# EAGLE design IrrigationSystemShield (EAGLE 6.5.0)
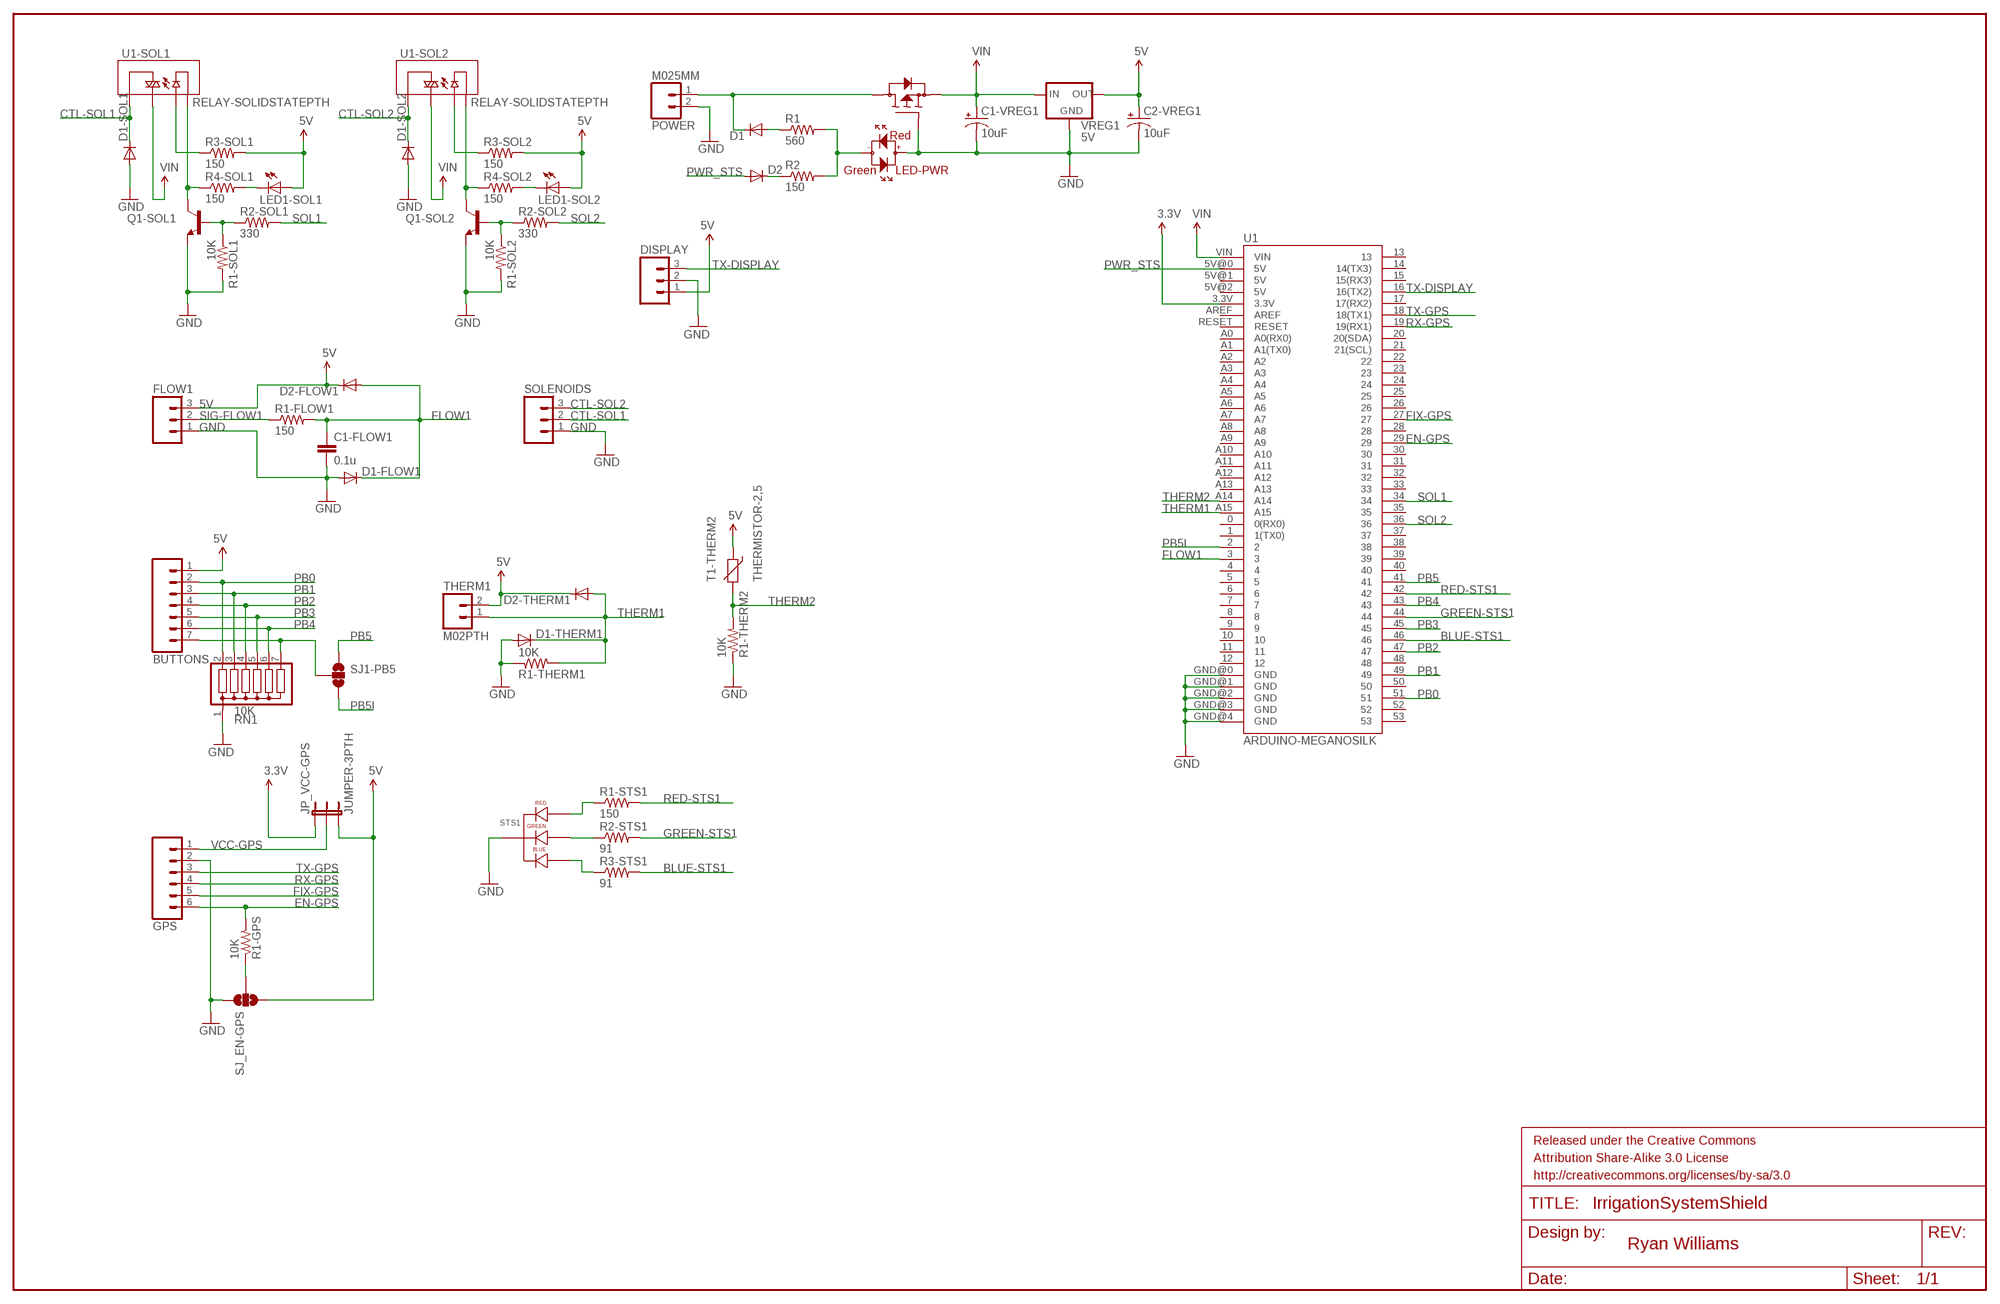
[diagram p0: schematic, sheet 1]

## Parts
BUTTONS  M07  [1X07]
C1-FLOW1  0.1u  CAPPTH1  [CAP-PTH-5MM]
C1-VREG1  10uF  10UF-25V-20%(PTH)  [CPOL-RADIAL-10UF-25V]
C2-VREG1  10uF  10UF-25V-20%(PTH)  [CPOL-RADIAL-10UF-25V]
D1  DIODEPTH  [DIODE-1N4001]
D1-FLOW1  DIODE1N4148  [DIODE-1N4148]
D1-SOL1  DIODEPTH  [DIODE-1N4001]
D1-SOL2  DIODEPTH  [DIODE-1N4001]
D1-THERM1  DIODE1N4148  [DIODE-1N4148]
D2  DIODEPTH  [DIODE-1N4001]
D2-FLOW1  DIODE1N4148  [DIODE-1N4148]
D2-THERM1  DIODE1N4148  [DIODE-1N4148]
DISPLAY  M03JST-PTH  [JST-3-PTH]
FET-1  P-FET  [FQP27P06]
FLOW1  M03-SCREW-5MM  [SCREWTERMINAL-5MM-3]
FRAME1  FRAME-LEDGER  [CREATIVE_COMMONS]
GPS  M06SIP  [1X06]
JP_VCC-GPS  JUMPER-3PTH  [1X03]
LED1-SOL1  LED5MM  [LED5MM]
LED1-SOL2  LED5MM  [LED5MM]
LED-PWR  LED-BIPOLARHGL*3362  [LED-5MM]
POWER  M025MM  [SCREWTERMINAL-5MM-2]
Q1-SOL1  TRANSISTOR_NPNTO92  [TO-92]
Q1-SOL2  TRANSISTOR_NPNTO92  [TO-92]
R1  560  RESISTORPTH-1/2W  [AXIAL-0.5]
R1-FLOW1  150  RESISTORPTH-1/4W  [AXIAL-0.4]
R1-GPS  10K  RESISTORPTH-1/4W  [AXIAL-0.4]
R1-SOL1  10K  RESISTORPTH-1/4W  [AXIAL-0.4]
R1-SOL2  10K  RESISTORPTH-1/4W  [AXIAL-0.4]
R1-STS1  150  RESISTORPTH-1/4W  [AXIAL-0.4]
R1-THERM1  10K  RESISTORPTH-1/4W  [AXIAL-0.4]
R1-THERM2  10K  RESISTORPTH-1/4W  [AXIAL-0.4]
R2  150  RESISTORPTH-1/4W  [AXIAL-0.4]
R2-SOL1  330  RESISTORPTH-1/4W  [AXIAL-0.4]
R2-SOL2  330  RESISTORPTH-1/4W  [AXIAL-0.4]
R2-STS1  91  RESISTORPTH-1/4W  [AXIAL-0.4]
R3-SOL1  150  RESISTORPTH-1/4W  [AXIAL-0.4]
R3-SOL2  150  RESISTORPTH-1/4W  [AXIAL-0.4]
R3-STS1  91  RESISTORPTH-1/4W  [AXIAL-0.4]
R4-SOL1  150  RESISTORPTH-1/4W  [AXIAL-0.4]
R4-SOL2  150  RESISTORPTH-1/4W  [AXIAL-0.4]
RN1  10K  G06R  [SIL7]
SJ1-PB5  SOLDERJUMPER_2WAYS  [SJ_3]
SJ_EN-GPS  SOLDERJUMPER_2WAYS  [SJ_3]
SOLENOIDS  M03-SCREW-5MM  [SCREWTERMINAL-5MM-3]
STS1  LED-RGB-CC-THRUDIFFUSE  [LED-RGB-THRU]
T1-THERM2  THERMISTOR-2,5  [RS-2,5]
THERM1  M02PTH  [1X02]
U1  ARDUINO-MEGANOSILK  [ARDUINO_MEGA_NOSILK]
U1-SOL1  RELAY-SOLIDSTATEPTH  [RELAY-S108T02]
U1-SOL2  RELAY-SOLIDSTATEPTH  [RELAY-S108T02]
VREG1  5V  V_REG_78XXSINK  [TO220-IGO]

## Nets
3.3V [Power]: JP_VCC-GPS.1 U1.3.3V
5V [Power]: BUTTONS.1 C2-VREG1.1(+) D2-FLOW1.C D2-THERM1.C DISPLAY.1 FLOW1.3 JP_VCC-GPS.3 LED1-SOL1.A LED1-SOL2.A R3-SOL1.P$2 R3-SOL2.P$2 SJ_EN-GPS.3 T1-THERM2.1 THERM1.2 VREG1.OUT
BLUE-STS1: R3-STS1.P$2 U1.46
CTL-SOL1: D1-SOL1.C SOLENOIDS.2 U1-SOL1.1(T1)
CTL-SOL2: D1-SOL2.C SOLENOIDS.3 U1-SOL2.1(T1)
EN-GPS: GPS.6 R1-GPS.P$2 U1.29
FIX-GPS: GPS.5 U1.27
FLOW1: C1-FLOW1.1 D1-FLOW1.C D2-FLOW1.A R1-FLOW1.P$2 U1.3
GND [Power]: C1-FLOW1.2 C1-VREG1.2(-) C2-VREG1.2(-) D1-FLOW1.A D1-SOL1.A D1-SOL2.A D1-THERM1.A DISPLAY.2 FET-1.GATE FLOW1.1 GPS.2 LED-PWR.ANODE POWER.2 Q1-SOL1.1(E) Q1-SOL2.1(E) R1-SOL1.P$2 R1-SOL2.P$2 R1-THERM1.P$1 R1-THERM2.P$1 RN1.1 SJ_EN-GPS.1 SOLENOIDS.1 STS1.2(CATHODE) U1.GND@0(GND) U1.GND@1(GND) U1.GND@2(GND) U1.GND@3(GND) U1.GND@4(GND) VREG1.GND
GREEN-STS1: R2-STS1.P$2 U1.44
N$1: Q1-SOL2.2(B) R1-SOL2.P$1 R2-SOL2.P$1
N$2: Q1-SOL1.2(B) R1-SOL1.P$1 R2-SOL1.P$1
N$3: LED1-SOL1.K(C) R4-SOL1.P$2
N$4: Q1-SOL1.3(C) R4-SOL1.P$1 U1-SOL1.4(-)
N$5: R3-SOL1.P$1 U1-SOL1.3(+)
N$6: LED1-SOL2.K(C) R4-SOL2.P$2
N$7: Q1-SOL2.3(C) R4-SOL2.P$1 U1-SOL2.4(-)
N$8: R3-SOL2.P$1 U1-SOL2.3(+)
N$9 [Power]: D1.C FET-1.DRAIN POWER.1
N$10: R1-STS1.P$1 STS1.1(RED_CATHODE)
N$11: R1-GPS.P$1 SJ_EN-GPS.2
N$12: R2-STS1.P$1 STS1.3(GREEN_CATHODE)
N$13: R3-STS1.P$1 STS1.4(BLUE_CATHODE)
N$14: D2.C R2.P$1
N$15: LED-PWR.CATHODE R1.P$2 R2.P$2
N$16: D1.A R1.P$1
PB0: BUTTONS.2 RN1.2 U1.51
PB1: BUTTONS.3 RN1.3 U1.49
PB2: BUTTONS.4 RN1.4 U1.47
PB3: BUTTONS.5 RN1.5 U1.45
PB4: BUTTONS.6 RN1.6 U1.43
PB5: SJ1-PB5.1 U1.41
PB5I: SJ1-PB5.3 U1.2
PB5RAW: BUTTONS.7 RN1.7 SJ1-PB5.2
PWR_STS: D2.A U1.5V@0(5V)
RED-STS1: R1-STS1.P$2 U1.42
RX-GPS: GPS.4 U1.19(19(RX1))
SIG-FLOW1: FLOW1.2 R1-FLOW1.P$1
SOL1: R2-SOL1.P$2 U1.34
SOL2: R2-SOL2.P$2 U1.36
THERM1: D1-THERM1.C D2-THERM1.A R1-THERM1.P$2 THERM1.1 U1.A15
THERM2: R1-THERM2.P$2 T1-THERM2.2 U1.A14
TX-DISPLAY: DISPLAY.3 U1.16(16(TX2))
TX-GPS: GPS.3 U1.18(18(TX1))
VCC-GPS: GPS.1 JP_VCC-GPS.2
VIN [Power]: C1-VREG1.1(+) FET-1.SOURCE U1-SOL1.2(T2) U1-SOL2.2(T2) U1.VIN VREG1.IN
Unconnected: U1.0(0(RX0)) U1.1(1(TX0)) U1.4 U1.5 U1.5V@1(5V) U1.5V@2(5V) U1.6 U1.7 U1.8 U1.9 U1.10 U1.11 U1.12 U1.13 U1.14(14(TX3)) U1.15(15(RX3)) U1.17(17(RX2)) U1.20(20(SDA)) U1.21(21(SCL)) U1.22 U1.23 U1.24 U1.25 U1.26 U1.28 U1.30 U1.31 U1.32 U1.33 U1.35 U1.37 U1.38 U1.39 U1.40 U1.48 U1.50 U1.52 U1.53 U1.A0(A0(RX0)) U1.A1(A1(TX0)) U1.A2 U1.A3 U1.A4 U1.A5 U1.A6 U1.A7 U1.A8 U1.A9 U1.A10 U1.A11 U1.A12 U1.A13 U1.AREF U1.RESET

## Library data of the parts
BUTTONS = SparkFun-Connectors:M07: Header 7 Standard 7-pin 0.1" header. Use with straight break away headers (SKU : PRT-00116), right angle break away headers (PRT-00553), swiss pins (PRT-00743), machine pins (PRT-00117), and female headers (PRT-00115). NOTES ON THE VARIANTS LOCK and LOCK_LONGPADS... This footprint was designed to help hold the alignment of a through-hole component (i.e. 7-pin header) while soldering it into place. You may notice that each hole has been shifted either up or down by 0.005 of an inch from it's more standard position (which is usually a perfectly straight line). This slight alteration caused the pins (the squares in the middle) to touch the edges of the holes. Because they are alternating, it causes a "brace" to hold the header in place. 0.005 has proven to be the perfect amount of "off-center" position when using our standard breakaway headers. Although looks a little odd when you look at the bare footprint, once you have a header in there, the alteration is very hard to notice. Also, if you push a header all the way into place, it is covered up entirely on the bottom side. This idea of altering the position of holes to aid alignment will be further integrated into the Sparkfun Library for other footprints. It can help hold any component with 3 or more connection pins.
C1-FLOW1 = SparkFun-Capacitors:CAP: Capacitor Standard 0603 ceramic capacitor, and 0.1" leaded capacitor.
C1-VREG1 C2-VREG1 = SparkFun-Capacitors:10UF-25V-20%(PTH): CAP-08440; PROD_ID: CAP-08440
D1 D1-FLOW1 D1-SOL1 D1-SOL2 D1-THERM1 D2 D2-FLOW1 D2-THERM1 = SparkFun-DiscreteSemi:DIODE: Diode These are standard reverse protection diodes and small signal diodes. SMA package can handle up to about 1A. SOD-323 can handle about 200mA. What the SOD-323 package when ordering, there are some mfgs out there that are 5-pin packages.
DISPLAY FLOW1 SOLENOIDS = SparkFun-Connectors:M03: Header 3 Standard 3-pin 0.1" header. Use with straight break away headers (SKU : PRT-00116), right angle break away headers (PRT-00553), swiss pins (PRT-00743), machine pins (PRT-00117), and female headers (PRT-00115). Molex polarized connector foot print use with SKU : PRT-08232 with associated crimp pins and housings.
FET-1 = Library:P-FET
FRAME1 = SparkFun-Aesthetics:FRAME-LEDGER: Schematic Frame Standard 11x14 US Ledger frame
GPS = SparkFun-Connectors:M06: Header 6 Standard 6-pin 0.1" header. Use with straight break away headers (SKU : PRT-00116), right angle break away headers (PRT-00553), swiss pins (PRT-00743), machine pins (PRT-00117), and female headers (PRT-00115). Molex polarized connector foot print use with SKU : PRT-08094 with associated crimp pins and housings. NOTES ON THE VARIANTS LOCK and LOCK_LONGPADS... This footprint was designed to help hold the alignment of a through-hole component (i.e. 6-pin header) while soldering it into place. You may notice that each hole has been shifted either up or down by 0.005 of an inch from it's more standard position (which is a perfectly straight line). This slight alteration caused the pins (the squares in the middle) to touch the edges of the holes. Because they are alternating, it causes a "brace" to hold the component in place. 0.005 has proven to be the perfect amount of "off-center" position when using our standard breakaway headers. Although looks a little odd when you look at the bare footprint, once you have a header in there, the alteration is very hard to notice. Also,if you push a header all the way into place, it is covered up entirely on the bottom side. This idea of altering the position of holes to aid alignment will be further integrated into the Sparkfun Library for other footprints. It can help hold any component with 3 or more connection pins.
JP_VCC-GPS = SparkFun-Passives:JUMPER-3
LED1-SOL1 LED1-SOL2 = SparkFun-LED:LED: LEDs Standard schematic elements and footprints for 5mm, 3mm, 1206, and 0603 sized LEDs. 5mm - Spark Fun Electronics SKU : COM-00529 (and others)
LED-PWR = Library:LED-BIPOLAR; COLOR_FORWARD: Red; COLOR_REVERSE: Green
POWER THERM1 = SparkFun-Connectors:M02: Standard 2-pin 0.1" header. Use with - straight break away headers ( PRT-00116) - right angle break away headers (PRT-00553) - swiss pins (PRT-00743) - machine pins (PRT-00117) - female headers (PRT-00115) Molex polarized connector foot print use with: PRT-08233 with associated crimp pins and housings. 2.54_SCREWTERM for use with PRT-10571. 3.5mm Screw Terminal footprints for PRT-08084 5mm Screw Terminal footprints for use with PRT-08433
Q1-SOL1 Q1-SOL2 = SparkFun-DiscreteSemi:TRANSISTOR_NPN: Generic NPN BJT MMBT2222A - TRANS-08049 (SOT-23, 1A 40V) MPSA42 - TRANS-09116 (SOT-23, 500mA 300V) MMBT5088LT1G - TRANS-11160 (SOT-23, 50 mA 30V)
R1 R1-FLOW1 R1-GPS R1-SOL1 R1-SOL2 R1-STS1 R1-THERM1 R1-THERM2 R2 R2-SOL1 R2-SOL2 R2-STS1 R3-SOL1 R3-SOL2 R3-STS1 R4-SOL1 R4-SOL2 = SparkFun-Resistors:RESISTOR: Resistor Basic schematic elements and footprints for 0603, 1206, and PTH resistors.
RN1 = resistor-sil:G06R: SIL RESISTOR; OC_FARNELL: unknown; OC_NEWARK: unknown
SJ1-PB5 SJ_EN-GPS = SparkFun-Passives:SOLDERJUMPER_2WAY: Solder Jumper 2 way solder jumper
STS1 = Library:LED-RGB-CC-THRU: RGB Through-hole common cathode LED SparkFun Storefront: COM-00105 (Clear) COM-09264 (Diffuse); PROD_ID: DIO-09434
T1-THERM2 = varistor:THERMISTOR: THERMISTOR
U1 = SparkFun-Boards:ARDUINO-MEGA: Arduino Mega board footprint
U1-SOL1 U1-SOL2 = SparkFun-Electromechanical:RELAY-SOLIDSTATE: SPST SS relay
VREG1 = SparkFun-PowerIC:V_REG_78XX: Voltage Regulator Standard 7805 5V regulator. IGO (Input Ground Output). Spark Fun Electronics SKU : COM-00107

## Net classes
1 Power: width 0.01 mm

## Board
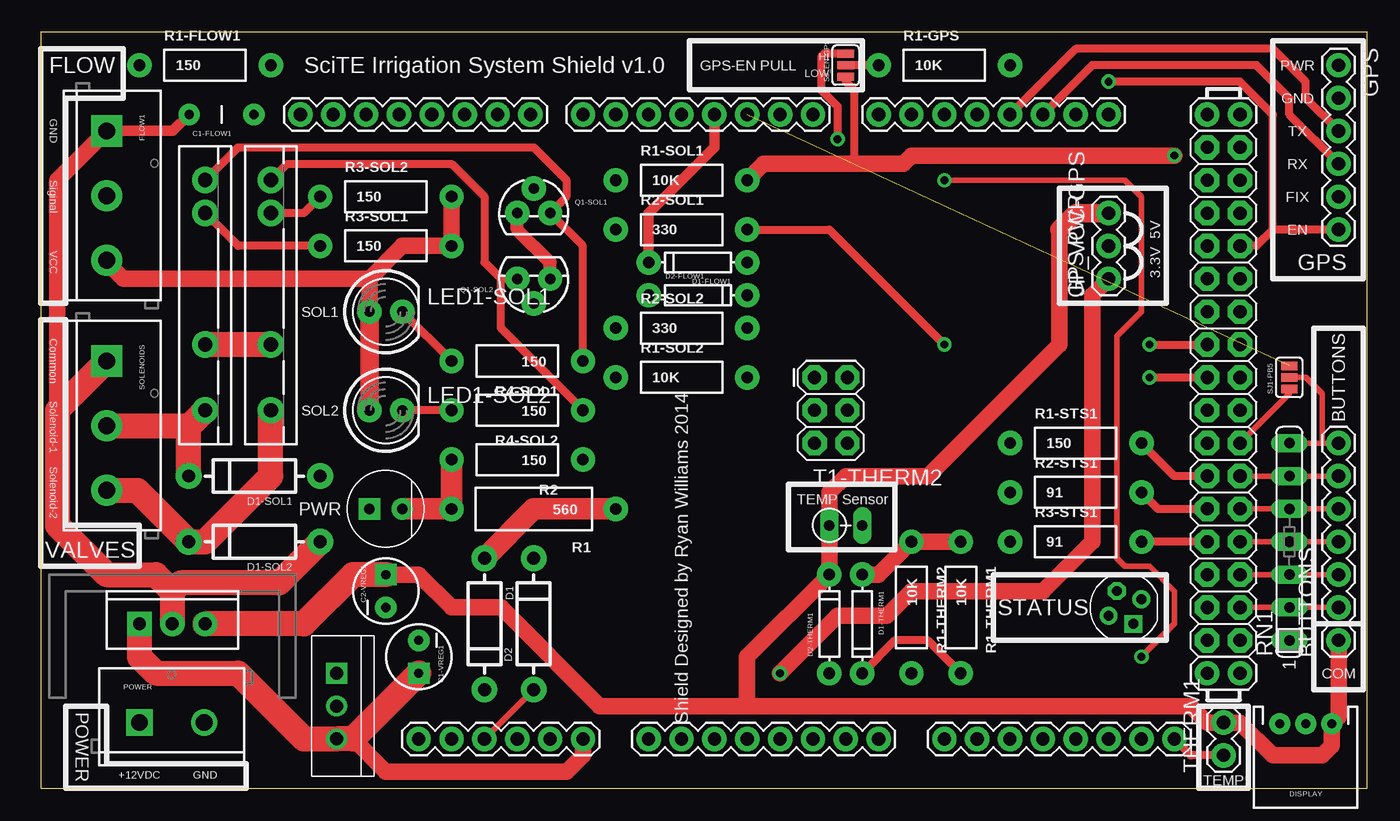
[diagram p1: board, top side]
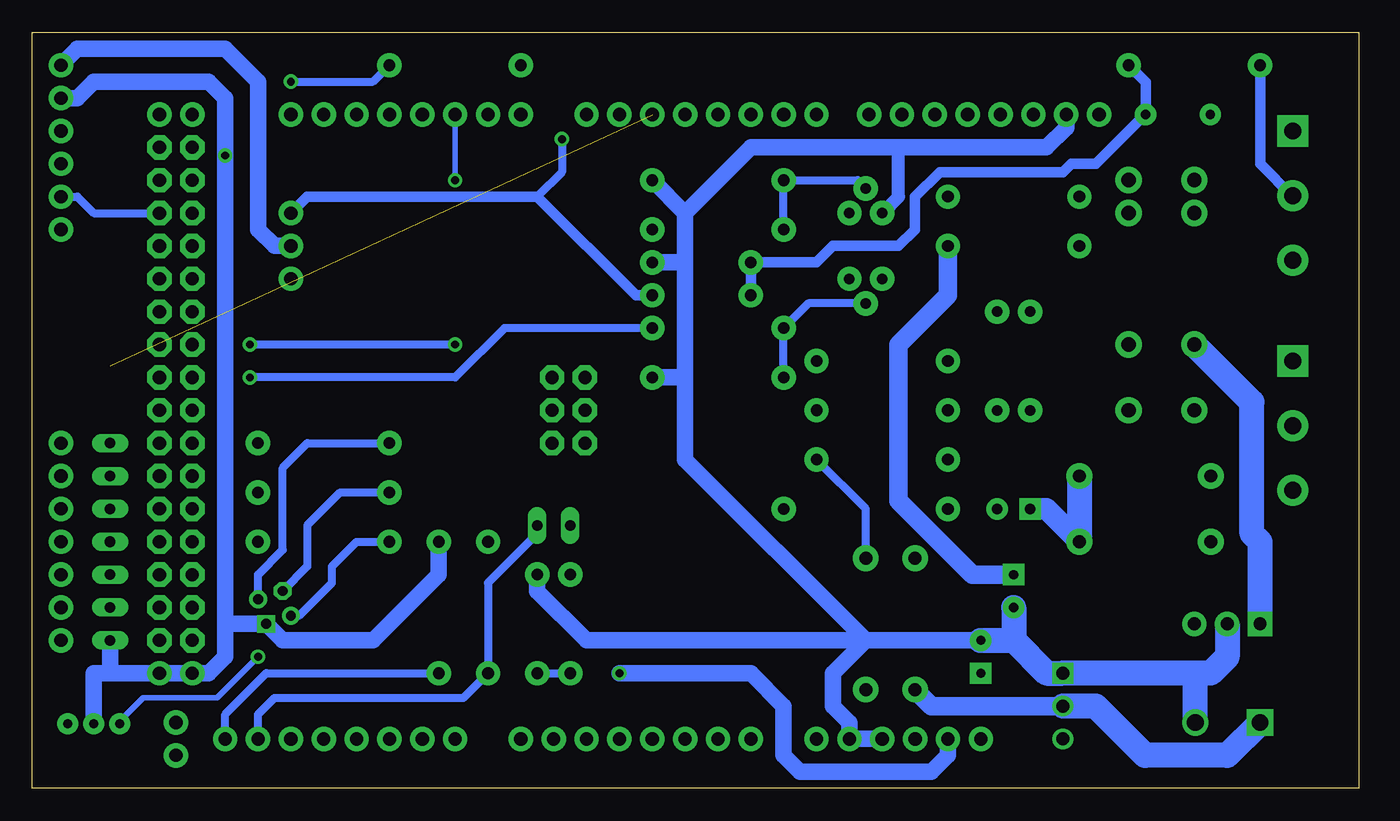
[diagram p2: board, bottom side, seen from below]

Size 102.54 x 58.41 mm. Coordinates in mm from the lower left corner, seen from the top.
Outline: 0,0 102.54,0 102.54,58.41 0,58.41 0,0
Copper layers (1*16): Top 0.035mm / dielectric 1.5mm / Bottom 0.035mm
Design rules "SparkFun": minimum track width 8mil, minimum drill 20mil, track to track 8mil, track to pad 8mil, pad to pad 8mil, via to via 8mil, smd to smd 8mil, copper to edge 8mil, drill to drill 8mil, minimum pad ring 12mil, minimum via ring 10mil, stop-mask expansion 4mil, vias tented up to drill 20mil, thermal gap 10mil

### Footprints (pad centres in the part's own frame; a part is rotated, then mirrored left to right if it is on the bottom)
1X07 = drill 1.016 pad 1.88: 1 0,0; 2 2.54,0; 3 5.08,0; 4 7.62,0; 5 10.16,0; 6 12.7,0; 7 15.24,0
CAP-PTH-5MM = drill 0.7 pad 1.651: 1 -2.5,0; 2 2.5,0
CPOL-RADIAL-10UF-25V = drill 0.7 pad 1.651 square: 1 1.27,0 | drill 0.7 pad 1.651: 2 -1.27,0
DIODE-1N4001 = drill 1 pad 1.981: A -5.08,0; C 5.08,0
DIODE-1N4148 = drill 0.9 pad 1.88: A -3.81,0; C 3.81,0
JST-3-PTH = drill 0.7 pad 1.626: 1 -2,-5; 2 0,-5; 3 2,-5
FQP27P06 = drill 1: DRAIN 0,0; SOURCE 2.54,0 | drill 1 square: GATE -2.54,0
SCREWTERMINAL-5MM-3 = drill 1.3 pad 2.413 square: 1 0,0 | drill 1.3 pad 2.413: 2 5,0; 3 10,0
1X06 = drill 1.016 pad 1.88: 1 0,0; 2 2.54,0; 3 5.08,0; 4 7.62,0; 5 10.16,0; 6 12.7,0
1X03 = drill 1.016 pad 1.88: 1 0,0; 2 2.54,0; 3 5.08,0
LED5MM = drill 0.813 pad 1.88: A -1.27,0; K 1.27,0
LED-5MM = drill 0.8 pad 1.676 square: ANODE -1.27,0 | drill 0.8 pad 1.676: CATHODE 1.27,0
SCREWTERMINAL-5MM-2 = drill 1.3 pad 2.032 square: 1 0,0 | drill 1.3 pad 2.032: 2 5,0
TO-92 = drill 0.813 pad 1.88: 1 -1.27,0; 2 0,1.905; 3 1.27,0
AXIAL-0.5 = drill 0.9 pad 1.88: P$1 -6.35,0; P$2 6.35,0
AXIAL-0.4 = drill 0.9 pad 1.88: P$1 -5.08,0; P$2 5.08,0
SIL7 = drill 0.813 long: 1 -7.62,0; 2 -5.08,0; 3 -2.54,0; 4 0,0; 5 2.54,0; 6 5.08,0; 7 7.62,0
SJ_3 = smd 0.635 x 1.27: 1 -0.889,0; 2 0,0; 3 0.889,0
LED-RGB-THRU = drill 0.762: 1 1.27,0.635; 4 -1.27,-0.635 | drill 0.762 square: 2 0.635,-1.27 | drill 0.762 octagon: 3 -0.635,1.27
RS-2,5 = drill 0.813 long: 1 -1.27,0; 2 1.27,0
1X02 = drill 1.016 pad 1.88: 1 0,0; 2 2.54,0
ARDUINO_MEGA_NOSILK = drill 1.016 pad 1.88: 0 63.5,50.8; 1 60.96,50.8; 2 58.42,50.8; 3 55.88,50.8; 3.3V 35.56,2.54; 4 53.34,50.8; 5 50.8,50.8; 5V@0 38.1,2.54; 5V@1 93.98,50.8; 5V@2 96.52,50.8; 6 48.26,50.8; 7 45.72,50.8; 8 41.656,50.8; 9 39.116,50.8; 10 36.576,50.8; 11 34.036,50.8; 12 31.496,50.8; 13 28.956,50.8; 14 68.58,50.8; 15 71.12,50.8; 16 73.66,50.8; 17 76.2,50.8; 18 78.74,50.8; 19 81.28,50.8; 20 83.82,50.8; 21 86.36,50.8; A0 50.8,2.54; A1 53.34,2.54; A2 55.88,2.54; A3 58.42,2.54; A4 60.96,2.54; A5 63.5,2.54; A6 66.04,2.54; A7 68.58,2.54; A8 73.66,2.54; A9 76.2,2.54; A10 78.74,2.54; A11 81.28,2.54; A12 83.82,2.54; A13 86.36,2.54; A14 88.9,2.54; A15 91.44,2.54; AREF 23.876,50.8; GND@0 40.64,2.54; GND@1 43.18,2.54; GND@2 93.98,7.62; GND@3 96.52,7.62; GND@4 26.416,50.8; RESET 33.02,2.54; VIN 45.72,2.54 | drill 1.016 pad 1.88 octagon: 22 93.98,48.26; 23 96.52,48.26; 24 93.98,45.72; 25 96.52,45.72; 26 93.98,43.18; 27 96.52,43.18; 28 93.98,40.64; 29 96.52,40.64; 30 93.98,38.1; 31 96.52,38.1; 32 93.98,35.56; 33 96.52,35.56; 34 93.98,33.02; 35 96.52,33.02; 36 93.98,30.48; 37 96.52,30.48; 38 93.98,27.94; 39 96.52,27.94; 40 93.98,25.4; 41 96.52,25.4; 42 93.98,22.86; 43 96.52,22.86; 44 93.98,20.32; 45 96.52,20.32; 46 93.98,17.78; 47 96.52,17.78; 48 93.98,15.24; 49 96.52,15.24; 50 93.98,12.7; 51 96.52,12.7; 52 93.98,10.16; 53 96.52,10.16; ICSP-GND 66.167,25.4; ICSP-MISO 63.627,30.48; ICSP-MOSI 66.167,27.94; ICSP-RESET 63.627,25.4; ICSP-SCK 63.627,27.94; ICSP-VCC 66.167,30.48
RELAY-S108T02 = drill 1.1 pad 2.032: 1 -8.88,0; 2 -3.8,0; 3 6.36,0; 4 8.9,0
TO220-IGO = drill 1 pad 1.88: GND 0,0; OUT 2.54,0 | drill 1 pad 1.88 square: IN -2.54,0

### Placement (x,y rotation side)
BUTTONS  100.33,11.43 90 top
C1-FLOW1  13.97,52.07 180 top
C1-VREG1  29.21,10.16 270 top
C2-VREG1  26.67,15.24 90 top
D1  34.29,12.7 270 top
D1-FLOW1  50.8,40.64 180 top
D1-SOL1  16.51,24.13 180 top
D1-SOL2  16.51,19.05 180 top
D1-THERM1  63.5,12.7 270 top
D2  38.1,12.7 90 top
D2-FLOW1  50.8,38.1 0 top
D2-THERM1  60.96,12.7 90 top
DISPLAY  97.79,0 180 top
FET-1  22.86,6.35 270 top
FLOW1  5.08,50.8 270 top
FRAME1  26.67,63.5 0 top  (outside the outline)
GPS  100.33,55.88 270 top
JP_VCC-GPS  82.55,39.37 90 top
LED1-SOL1  26.67,36.83 0 top
LED1-SOL2  26.67,29.21 0 top
LED-PWR  26.67,21.59 0 top
POWER  7.62,5.08 0 top
Q1-SOL1  38.1,44.45 0 top
Q1-SOL2  38.1,39.37 180 top
R1  38.1,21.59 180 top
R1-FLOW1  12.7,55.88 0 top
R1-GPS  69.85,55.88 0 top
R1-SOL1  49.53,46.99 0 top
R1-SOL2  49.53,31.75 0 top
R1-STS1  80.01,26.67 0 top
R1-THERM1  71.12,13.97 270 top
R1-THERM2  67.31,13.97 270 top
R2  36.83,25.4 180 top
R2-SOL1  49.53,43.18 0 top
R2-SOL2  49.53,35.56 0 top
R2-STS1  80.01,22.86 0 top
R3-SOL1  26.67,41.91 0 top
R3-SOL2  26.67,45.72 0 top
R3-STS1  80.01,19.05 0 top
R4-SOL1  36.83,33.02 180 top
R4-SOL2  36.83,29.21 180 top
RN1  96.52,19.05 90 top
SJ1-PB5  96.52,31.75 90 top
SJ_EN-GPS  62.23,55.88 90 top
SOLENOIDS  5.08,33.02 270 top
STS1  83.82,13.97 0 top
T1-THERM2  62.23,20.32 0 top
THERM1  91.44,2.54 90 top
U1  -3.81,1.27 0 top
U1-SOL1  12.7,38.1 90 top
U1-SOL2  17.78,38.1 90 top
VREG1  10.16,12.7 0 top

### Tracks (layer width: path | path; a pad name or v marks a point on that pad's centre or on a via)
3.3V  (via drill 0.6)
  Top 1.27: JP_VCC-GPS.1 81.28,38.1 81.28,19.05 77.47,15.24 67.31,15.24 65.41,13.34 61.59,13.34 v57.15,8.89
  Bottom 1.27: U1.3.3V 31.75,2.54 33.02,1.27 43.18,1.27 44.45,2.54 44.45,6.35 46.99,8.89 v57.15,8.89
5V  (via drill 0.6)
  Top 0.61: SJ_EN-GPS.3 60.58,56.77 60.33,56.52 60.33,53.98 61.59,52.7 v61.59,50.16
  Top 1.27: BUTTONS.1 100.33,5.54 DISPLAY.1 99.79,3.27 99.06,2.54 95.25,2.54 92.71,5.08 THERM1.2 90.17,5.08 88.9,6.35 54.61,6.35 | C2-VREG1.1 29.21,16.51 31.75,13.97 35.56,13.97 43.18,6.35 54.61,6.35 | 25.4,39.37 27.94,41.91 R3-SOL1.P$2 R3-SOL2.P$2 | 25.4,39.37 LED1-SOL1.A | FLOW1.3 5.08,40.64 6.35,39.37 25.4,39.37 | 78.74,43.18 78.74,34.29 68.58,24.13 62.23,24.13 60.96,22.86 T1-THERM2.1 D2-THERM1.C 54.61,10.16 54.61,6.35
  Top 1.422: LED1-SOL2.A LED1-SOL1.A | JP_VCC-GPS.3 80.01,44.45 78.74,43.18
  Top 1.93: C2-VREG1.1 24.13,16.51 20.32,12.7 VREG1.OUT
  Bottom 0.61: v61.59,50.16 61.59,47.62 63.5,45.72
  Bottom 0.813: JP_VCC-GPS.3 81.28,45.72 63.5,45.72 55.88,38.1 D2-FLOW1.C
  Bottom 1.422: C2-VREG1.1 29.84,16.51 35.56,22.23 35.56,34.29 31.75,38.1 R3-SOL1.P$2
BLUE-STS1
  Top 0.61: U1.46 R3-STS1.P$2
CTL-SOL1
  Top 1.93: SOLENOIDS.2 11.43,28.02 | 11.43,28.02 11.5,28.02 U1-SOL1.1 | D1-SOL1.C 11.43,28.02
CTL-SOL2
  Top 1.93: SOLENOIDS.3 7.46,23.02 D1-SOL2.C 12.7,19.05 17.78,24.13 U1-SOL2.1
EN-GPS  (via drill 0.6)
  Top 0.61: GPS.6 95.25,43.18 | 95.25,43.18 93.98,41.91 U1.29 | 95.25,43.18 95.25,52.07 92.71,54.61 v82.55,54.61
  Bottom 0.61: v82.55,54.61 76.2,54.61 R1-GPS.P$2
FIX-GPS
  Bottom 0.61: GPS.5 99.06,45.72 97.79,44.45 U1.27
FLOW1
  Top 0.813: D1-FLOW1.C 46.99,44.45 52.07,49.53 U1.3
  Bottom 0.813: D2-FLOW1.A D1-FLOW1.C 41.91,40.64 40.64,41.91 35.56,41.91 34.29,43.18 34.29,45.72 32.38,47.62 22.86,47.62 22.23,48.26 20.32,48.26 16.51,52.07 C1-FLOW1.1 16.47,54.57 R1-FLOW1.P$2
GND  (via drill 0.6)
  Top 0.61: SJ_EN-GPS.1 62.23,54.61 62.87,53.98 62.87,48.26
  Top 0.813: FLOW1.1 10.2,50.8 C1-FLOW1.2
  Top 1.016: Q1-SOL2.1 39.37,40.64 36.83,43.18 Q1-SOL1.1
  Top 1.27: FLOW1.1 1.27,46.99 1.27,29.21 | R1-SOL1.P$2 55.88,48.26 62.87,48.26 66.67,48.26 67.31,48.9 v87.63,48.9 | R1-THERM1.P$1 R1-THERM2.P$1 64.77,16.51 D1-THERM1.A
  Top 1.93: SOLENOIDS.1 1.27,29.21 1.27,20.32 5.08,16.51 8.89,16.51 10.16,15.24 | 10.16,15.24 VREG1.GND | D1-SOL2.A 18.41,15.88 10.79,15.88 10.16,15.24
  Bottom 1.016: Q1-SOL1.1 35.56,45.72 35.56,49.53
  Bottom 1.27: DISPLAY.2 97.79,8.89 96.52,8.89 | 96.52,8.89 U1.GND@3 U1.GND@2 88.9,8.89 87.63,10.16 87.63,12.7 | RN1.1 96.52,8.89 | 87.63,12.7 v87.63,48.9 87.63,53.34 88.9,54.61 97.79,54.61 99.06,53.34 GPS.2 | C1-VREG1.2 38.1,11.43 | 38.1,11.43 40.64,8.89 40.64,6.35 39.37,5.08 U1.GND@1 U1.GND@0 | 38.1,11.43 52.07,25.4 52.07,31.75 | R1-SOL1.P$2 52.07,44.45 | U1.GND@4 22.61,51.05 24.13,49.53 35.56,49.53 46.99,49.53 52.07,44.45 | 52.07,40.64 52.07,31.75 | R1-SOL2.P$2 52.07,31.75 | D1-FLOW1.A 52.07,40.64 | 52.07,40.64 52.07,44.45 | 87.63,12.7 STS1.2 83.19,11.43 76.2,11.43 71.12,16.51 R1-THERM1.P$1 | 38.1,11.43 59.69,11.43 63.5,15.24 D1-THERM1.A
  Bottom 1.676: LED-PWR.ANODE 24.13,21.59 D1-SOL2.A
  Bottom 1.93: D1-SOL1.A D1-SOL2.A | POWER.2 12.62,8.81 12.7,8.89 | 12.7,8.89 FET-1.GATE 24.13,8.89 26.67,11.43 | VREG1.GND 10.16,10.16 11.43,8.89 12.7,8.89 | C1-VREG1.2 26.67,11.43 | C2-VREG1.2 26.67,11.43
GREEN-STS1
  Top 0.61: R2-STS1.P$2 86.36,21.59 U1.44
N$1
  Bottom 0.61: R1-SOL2.P$1 R2-SOL2.P$1 42.55,37.47 Q1-SOL2.2
N$2
  Bottom 0.61: R2-SOL1.P$1 R1-SOL1.P$1 38.73,46.99 Q1-SOL1.2
N$3
  Top 0.61: R4-SOL1.P$2 LED1-SOL1.K
N$4
  Top 0.61: U1-SOL1.4 15.24,49.53 38.1,49.53 40.64,46.99 40.64,45.72 Q1-SOL1.3 41.91,41.91 R4-SOL1.P$1
N$5
  Top 0.61: R3-SOL1.P$1 15.25,41.91 U1-SOL1.3
N$6
  Top 0.61: R4-SOL2.P$2 LED1-SOL2.K
N$7
  Top 0.61: U1-SOL2.4 19.05,48.26 31.75,48.26 34.29,45.72 34.29,40.64 35.56,39.37 | R4-SOL2.P$1 35.56,35.56 35.56,39.37 | Q1-SOL2.3 35.56,39.37
N$8
  Top 0.61: R3-SOL2.P$1 20.32,44.45 U1-SOL2.3
N$9
  Bottom 1.422: D1.C 33.02,6.35 FET-1.DRAIN
  Bottom 1.93: FET-1.DRAIN 20.32,6.35 16.51,2.54 10.16,2.54 POWER.1
N$10
  Bottom 0.61: R1-STS1.P$1 81.28,26.67 83.19,24.77 83.19,18.41 85.09,16.51 STS1.1
N$11
  Top 0.61: R1-GPS.P$1 SJ_EN-GPS.2
N$12
  Bottom 0.61: R2-STS1.P$1 78.74,22.86 81.28,20.32 81.28,17.14 STS1.3
N$13
  Bottom 0.61: R3-STS1.P$1 77.47,19.05 79.38,17.14 79.38,15.88 81.92,13.34 STS1.4
N$14
  Bottom 0.61: D2.C 38.1,21.59 R2.P$1
N$15
  Top 1.676: R2.P$2 R1.P$2 LED-PWR.CATHODE
N$16
  Top 1.676: D1.A 38.1,21.59 R1.P$1
PB0
  Top 0.406: U1.51 RN1.2 BUTTONS.2
PB1
  Top 0.406: U1.49 RN1.3 BUTTONS.3
PB2
  Top 0.406: BUTTONS.4 RN1.4 U1.47
PB3
  Top 0.406: U1.45 RN1.5 BUTTONS.5
PB4
  Top 0.406: BUTTONS.6 RN1.6 U1.43
PB5
  Top 0.406: SJ1-PB5.1 96.52,30.48 U1.41
PB5I  (1 unrouted)
PB5RAW
  Top 0.406: BUTTONS.7 99.06,26.67 | 99.06,26.67 RN1.7 | SJ1-PB5.2 97.79,31.75 99.06,30.48 99.06,26.67
PWR_STS
  Top 0.406: D2.A U1.5V@0
RED-STS1
  Top 0.61: U1.42 87.63,24.13 R1-STS1.P$2
RX-GPS
  Top 0.61: U1.19 81.28,55.88 93.98,55.88 96.52,53.34 96.52,52.07 GPS.4
SIG-FLOW1
  Bottom 0.813: R1-FLOW1.P$1 7.62,48.26 5.08,45.72 FLOW1.2
SOL1  (via drill 0.6)
  Top 0.61: R2-SOL1.P$2 60.96,43.18 v69.85,34.29 | v85.72,34.29 U1.34
  Bottom 0.61: v69.85,34.29 v85.72,34.29
SOL2  (via drill 0.6)
  Top 0.61: v85.72,31.75 U1.36
  Bottom 0.61: R2-SOL2.P$2 66.04,35.56 69.85,31.75 v85.72,31.75
THERM1
  Top 0.61: THERM1.1 88.9,2.54 U1.A15 | R1-THERM1.P$2 68.58,11.43 66.04,11.43 D1-THERM1.C
  Bottom 0.61: U1.A15 87.63,5.71 84.45,8.89 R1-THERM1.P$2 | D1-THERM1.C D2-THERM1.A
THERM2
  Bottom 0.61: T1-THERM2.2 63.5,19.68 67.31,15.88 R1-THERM2.P$2 69.22,6.99 83.82,6.99 85.09,5.71 U1.A14
TX-DISPLAY  (via drill 0.6)
  Top 0.406: v69.85,46.99 83.82,46.99 85.09,45.72 85.09,36.83 83.19,34.92 83.19,17.78 83.82,17.14 85.72,17.14 87.63,15.24 87.63,12.7 v85.09,10.16
  Bottom 0.406: DISPLAY.3 95.79,5.17 93.98,6.99 88.27,6.99 v85.09,10.16 | v69.85,46.99 U1.16
TX-GPS
  Top 0.61: U1.18 80.01,57.15 95.25,57.15 97.79,54.61 97.79,53.34 GPS.3
VCC-GPS
  Bottom 1.27: GPS.1 99.06,57.15 87.63,57.15 85.09,54.61 85.09,43.18 83.82,41.91 JP_VCC-GPS.2
VIN
  Top 1.27: U1.VIN 41.91,2.54 40.64,1.27 26.67,1.27 24.13,3.81
  Top 1.93: U1-SOL1.2 U1-SOL2.2 | VREG1.IN 7.62,10.16 8.89,8.89 15.24,8.89 20.32,3.81 FET-1.SOURCE 24.13,3.81 C1-VREG1.1
  Bottom 1.93: U1-SOL1.2 8.26,29.84 8.26,19.68 7.62,19.05 VREG1.IN

### Text on the board
tPlace: HI | FLOW | SciTE Irrigation System Shield v1.0 | GPS-EN PULL | PWR | LOW | GND | GND | TX | RX | Siginal | FIX | 5V | EN | GPS PWR | VCC | 3.3V | GPS | SOL1 | Common | BUTTONS | SOL2 | Solenoid-1 | Solenoid-2 | PWR | TEMP Sensor | VALVES | Shield Designed by Ryan Williams 2014 | STATUS | COM | POWER | +12VDC | GND | TEMP